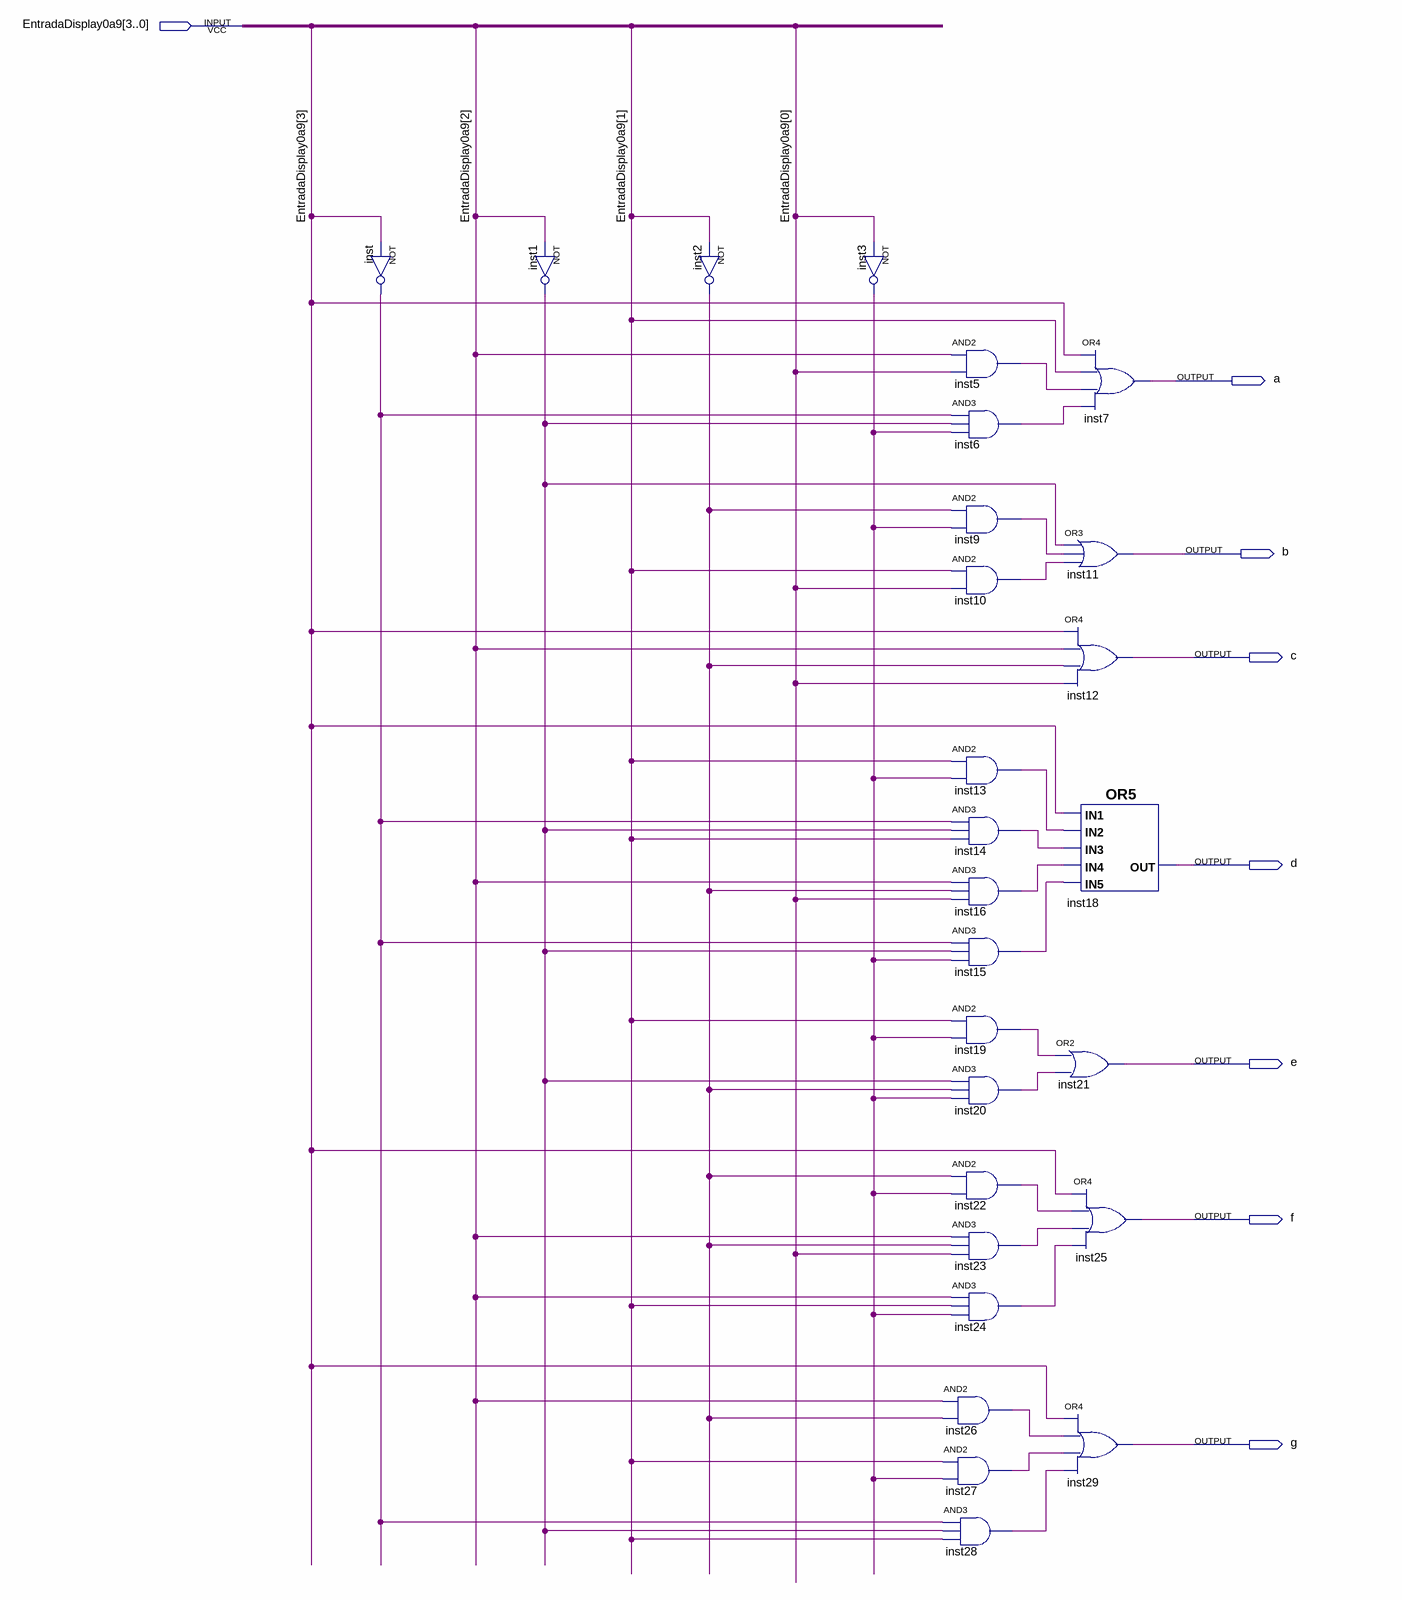
[diagram p0: schematic sheet]
// Quartus schematic Display0a9.bdf as structural Verilog: 27 symbols, 8 pins
module Display0a9 (
  input  [3:0] EntradaDisplay0a9,
  output a,
  output b,
  output c,
  output d,
  output e,
  output f,
  output g
);

  wire inst1_out, inst2_out, inst3_out, inst5_out, inst6_out, inst9_out, inst10_out, inst13_out, inst14_out,
       inst15_out, inst16_out, inst19_out, inst20_out, inst22_out, inst23_out, inst24_out, inst26_out,
       inst27_out, inst28_out, inst_out;

  not inst (inst_out, EntradaDisplay0a9[3]);
  not inst1 (inst1_out, EntradaDisplay0a9[2]);
  not inst2 (inst2_out, EntradaDisplay0a9[1]);
  not inst3 (inst3_out, EntradaDisplay0a9[0]);
  and inst26 (inst26_out, EntradaDisplay0a9[2], inst2_out);
  and inst27 (inst27_out, EntradaDisplay0a9[1], inst3_out);
  and inst28 (inst28_out, inst_out, inst1_out, EntradaDisplay0a9[1]);
  and inst5 (inst5_out, EntradaDisplay0a9[2], EntradaDisplay0a9[0]);
  and inst6 (inst6_out, inst_out, inst1_out, inst3_out);
  and inst9 (inst9_out, inst2_out, inst3_out);
  and inst10 (inst10_out, EntradaDisplay0a9[1], EntradaDisplay0a9[0]);
  and inst13 (inst13_out, EntradaDisplay0a9[1], inst3_out);
  and inst14 (inst14_out, inst_out, inst1_out, EntradaDisplay0a9[1]);
  and inst16 (inst16_out, EntradaDisplay0a9[2], inst2_out, EntradaDisplay0a9[0]);
  and inst15 (inst15_out, inst_out, inst1_out, inst3_out);
  and inst19 (inst19_out, EntradaDisplay0a9[1], inst3_out);
  and inst20 (inst20_out, inst1_out, inst2_out, inst3_out);
  and inst22 (inst22_out, inst2_out, inst3_out);
  and inst23 (inst23_out, EntradaDisplay0a9[2], inst2_out, EntradaDisplay0a9[0]);
  and inst24 (inst24_out, EntradaDisplay0a9[2], EntradaDisplay0a9[1], inst3_out);
  or inst7 (a, EntradaDisplay0a9[3], EntradaDisplay0a9[1], inst5_out, inst6_out);
  or inst11 (b, inst1_out, inst9_out, inst10_out);
  or inst12 (c, EntradaDisplay0a9[3], EntradaDisplay0a9[2], inst2_out, EntradaDisplay0a9[0]);
  or inst18 (d, EntradaDisplay0a9[3], inst13_out, inst14_out, inst16_out, inst15_out);
  or inst21 (e, inst19_out, inst20_out);
  or inst25 (f, EntradaDisplay0a9[3], inst22_out, inst23_out, inst24_out);
  or inst29 (g, EntradaDisplay0a9[3], inst26_out, inst27_out, inst28_out);
endmodule
